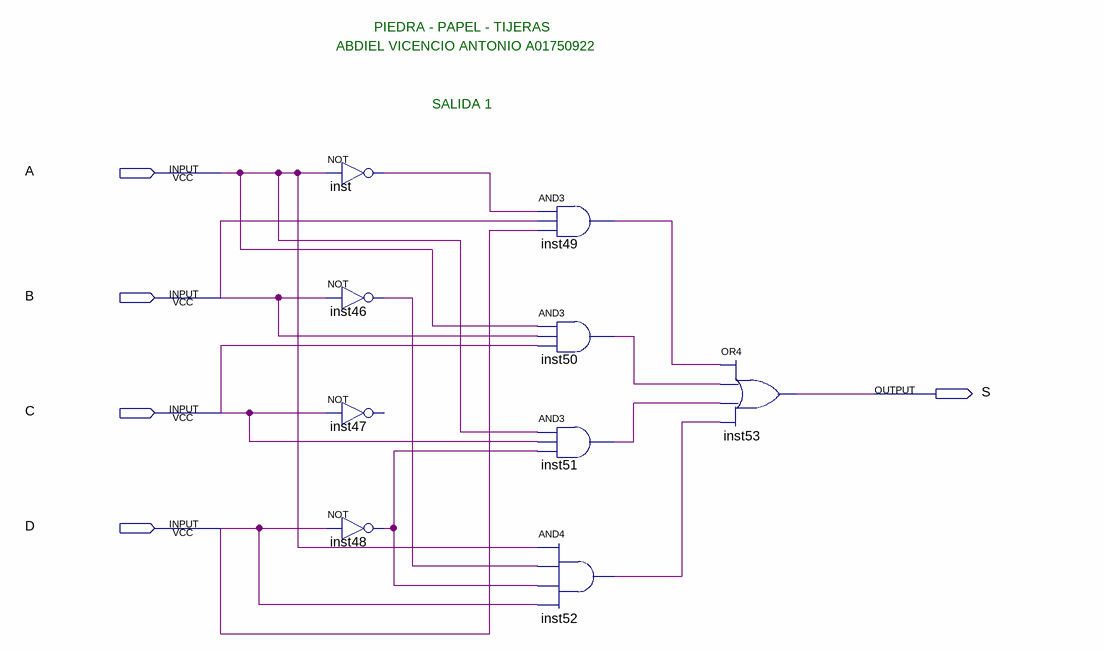
[diagram p0: schematic sheet]
// Quartus schematic PiedraPapelTijeras.bdf as structural Verilog: 9 symbols, 5 pins
module PiedraPapelTijeras (
  input  A,
  input  B,
  input  C,
  input  D,
  output S
);

  wire inst46_out, inst48_out, inst49_out, inst50_out, inst51_out, inst52_out, inst_out;

  not inst (inst_out, A);
  not inst46 (inst46_out, B);
  // NOT inst47 has open pins: IN=C, OUT=open
  not inst48 (inst48_out, D);
  and inst49 (inst49_out, inst_out, B, D);
  and inst50 (inst50_out, A, B, C);
  and inst51 (inst51_out, A, C, inst48_out);
  and inst52 (inst52_out, A, inst46_out, inst48_out, D);
  or inst53 (S, inst49_out, inst50_out, inst51_out, inst52_out);

  // Notes on the sheet:
  //   PIEDRA - PAPEL - TIJERAS
  //   ABDIEL VICENCIO ANTONIO A01750922
  //   SALIDA 1
endmodule
